# EAGLE design untitled (EAGLE 9.4.2)
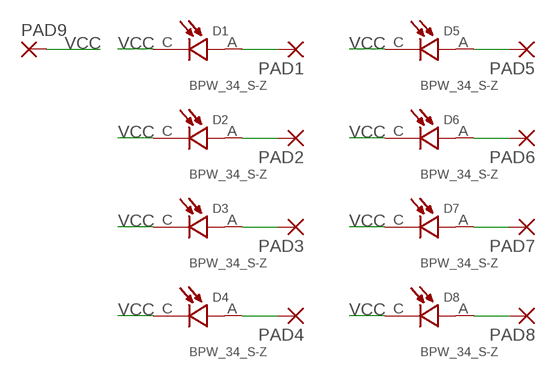
[diagram p0: schematic, sheet 1]

## Parts
D1  BPW_34_S-Z  [DIO_BPW_34_S-Z]
D2  BPW_34_S-Z  [DIO_BPW_34_S-Z]
D3  BPW_34_S-Z  [DIO_BPW_34_S-Z]
D4  BPW_34_S-Z  [DIO_BPW_34_S-Z]
D5  BPW_34_S-Z  [DIO_BPW_34_S-Z]
D6  BPW_34_S-Z  [DIO_BPW_34_S-Z]
D7  BPW_34_S-Z  [DIO_BPW_34_S-Z]
D8  BPW_34_S-Z  [DIO_BPW_34_S-Z]
PAD1  SMD2  [SMD1,27-2,54]
PAD2  SMD2  [SMD1,27-2,54]
PAD3  SMD2  [SMD1,27-2,54]
PAD4  SMD2  [SMD1,27-2,54]
PAD5  SMD2  [SMD1,27-2,54]
PAD6  SMD2  [SMD1,27-2,54]
PAD7  SMD2  [SMD1,27-2,54]
PAD8  SMD2  [SMD1,27-2,54]
PAD9  SMD2  [SMD1,27-2,54]

## Nets
N$9: D1.A PAD1.1(P)
N$10: D2.A PAD2.1(P)
N$11: D3.A PAD3.1(P)
N$12: D4.A PAD4.1(P)
N$13: D5.A PAD5.1(P)
N$14: D6.A PAD6.1(P)
N$15: D7.A PAD7.1(P)
N$16: D8.A PAD8.1(P)
VCC: D1.C D2.C D3.C D4.C D5.C D6.C D7.C D8.C PAD9.1(P)

## Library data of the parts
D1-D8 = BPW_34_S-Z:BPW_34_S-Z: Silicon PIN Photodiode; DESCRIPTION: Photodiode PIN Chip 850nm 0.62A/W Sensitivity 2-Pin DIL SMT; DIGI-KEY_PART_NUMBER: 475-2659-1-ND; DIGI-KEY_PURCHASE_URL: https://www.digikey.com/product-detail/en/osram-opto-semiconductors-inc/BPW-34-S-Z/475-2659-1-ND/1893861?utm_source=snapeda&utm_medium=aggregator&utm_campaign=symbol; MF: OSRAM Opto; MP: BPW 34 S-Z; PACKAGE: SMD-2 OSRAM Opto
PAD1-PAD9 = wirepad:SMD2: SMD PAD

## Board
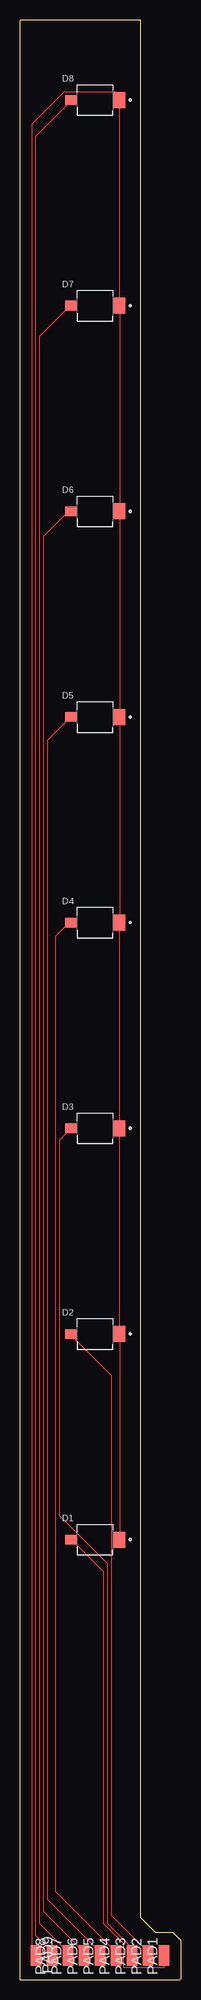
[diagram p1: board, top side]

Size 20.11 x 245.01 mm. Coordinates in mm from the lower left corner, seen from the top.
Outline: 20,0 0,0 0,245
Outline: 0.01,245.01 15.01,245.01 15.01,7.81 16.91,5.91 19.11,5.91 20.11,4.91 20.11,0.01 20.01,0.01
Copper layers (1*16): Top 0.035mm / dielectric 1.5mm / Bottom 0.035mm
Design rules "default": minimum track width 6mil, minimum drill 0.35mm, track to track 6mil, track to pad 6mil, pad to pad 6mil, via to via 6mil, smd to smd 6mil, copper to edge 40mil, drill to drill 6mil, minimum pad ring 10mil, minimum via ring 8mil, stop-mask expansion 4mil, vias tented up to drill 0mil, thermal gap 10mil

### Footprints (pad centres in the part's own frame; a part is rotated, then mirrored left to right if it is on the bottom)
DIO_BPW_34_S-Z = smd 1.4 x 1.2: A -3.05,0 | smd 1.4 x 2: C 3.05,0
SMD1,27-2,54 = smd 1.27 x 2.54: 1 0,0

### Placement (x,y rotation side)
D1  9.38,55 0 top
D2  9.38,80.71 0 top
D3  9.38,106.43 0 top
D4  9.38,132.14 0 top
D5  9.38,157.86 0 top
D6  9.38,183.57 0 top
D7  9.38,209.29 0 top
D8  9.38,235 0 top
PAD1  18,3 0 top
PAD2  16,3 0 top
PAD3  14,3 0 top
PAD4  12,3 0 top
PAD5  10,3 0 top
PAD6  8,3 0 top
PAD7  6,3 0 top
PAD8  4,3 0 top
PAD9  2,3 180 top

### Tracks (layer width: path | path; a pad name or v marks a point on that pad's centre or on a via)
N$9
  Top 0.152: PAD1.1 18,1.5 13,1.5 13,4.5 10.5,7 10.5,51 6.5,55 D1.A
N$10
  Top 0.152: PAD2.1 16,3.5 11.5,8 11.5,75.5 6.5,80.5 D2.A
N$11
  Top 0.152: PAD3.1 14,4 11,7 11,52 5,58 5,105 6,106 D3.A
N$12
  Top 0.152: PAD4.1 12,3.5 4.5,11 4.5,130.5 6,132 D4.A
N$13
  Top 0.152: PAD5.1 10,3.5 3.5,10 3.5,155 6,157.5 D5.A
N$14
  Top 0.152: PAD6.1 8,3.5 3,8.5 3,180.5 6,183.5 D6.A
N$15
  Top 0.152: PAD7.1 6,3.5 2.5,7 2.5,205.5 6,209 D7.A
N$16
  Top 0.152: PAD8.1 4,3.5 2,5.5 2,230.5 6,234.5 D8.A
VCC
  Top 0.152: D1.C 12.5,55 12.5,80.5 D2.C 12.5,81 12.5,106 D3.C 12.5,106.5 12.5,132 D4.C 12.5,132.5 12.5,157.5 D5.C 12.5,158 12.5,183.5 D6.C 12.5,184 12.5,209 D7.C 12.5,209.5 12.5,234.5 D8.C 12,235 12,236 5.5,236 1.5,232 1.5,3.5 PAD9.1